# EAGLE design nRF24L01+ - ATmega328 test board (EAGLE 7.6.0)
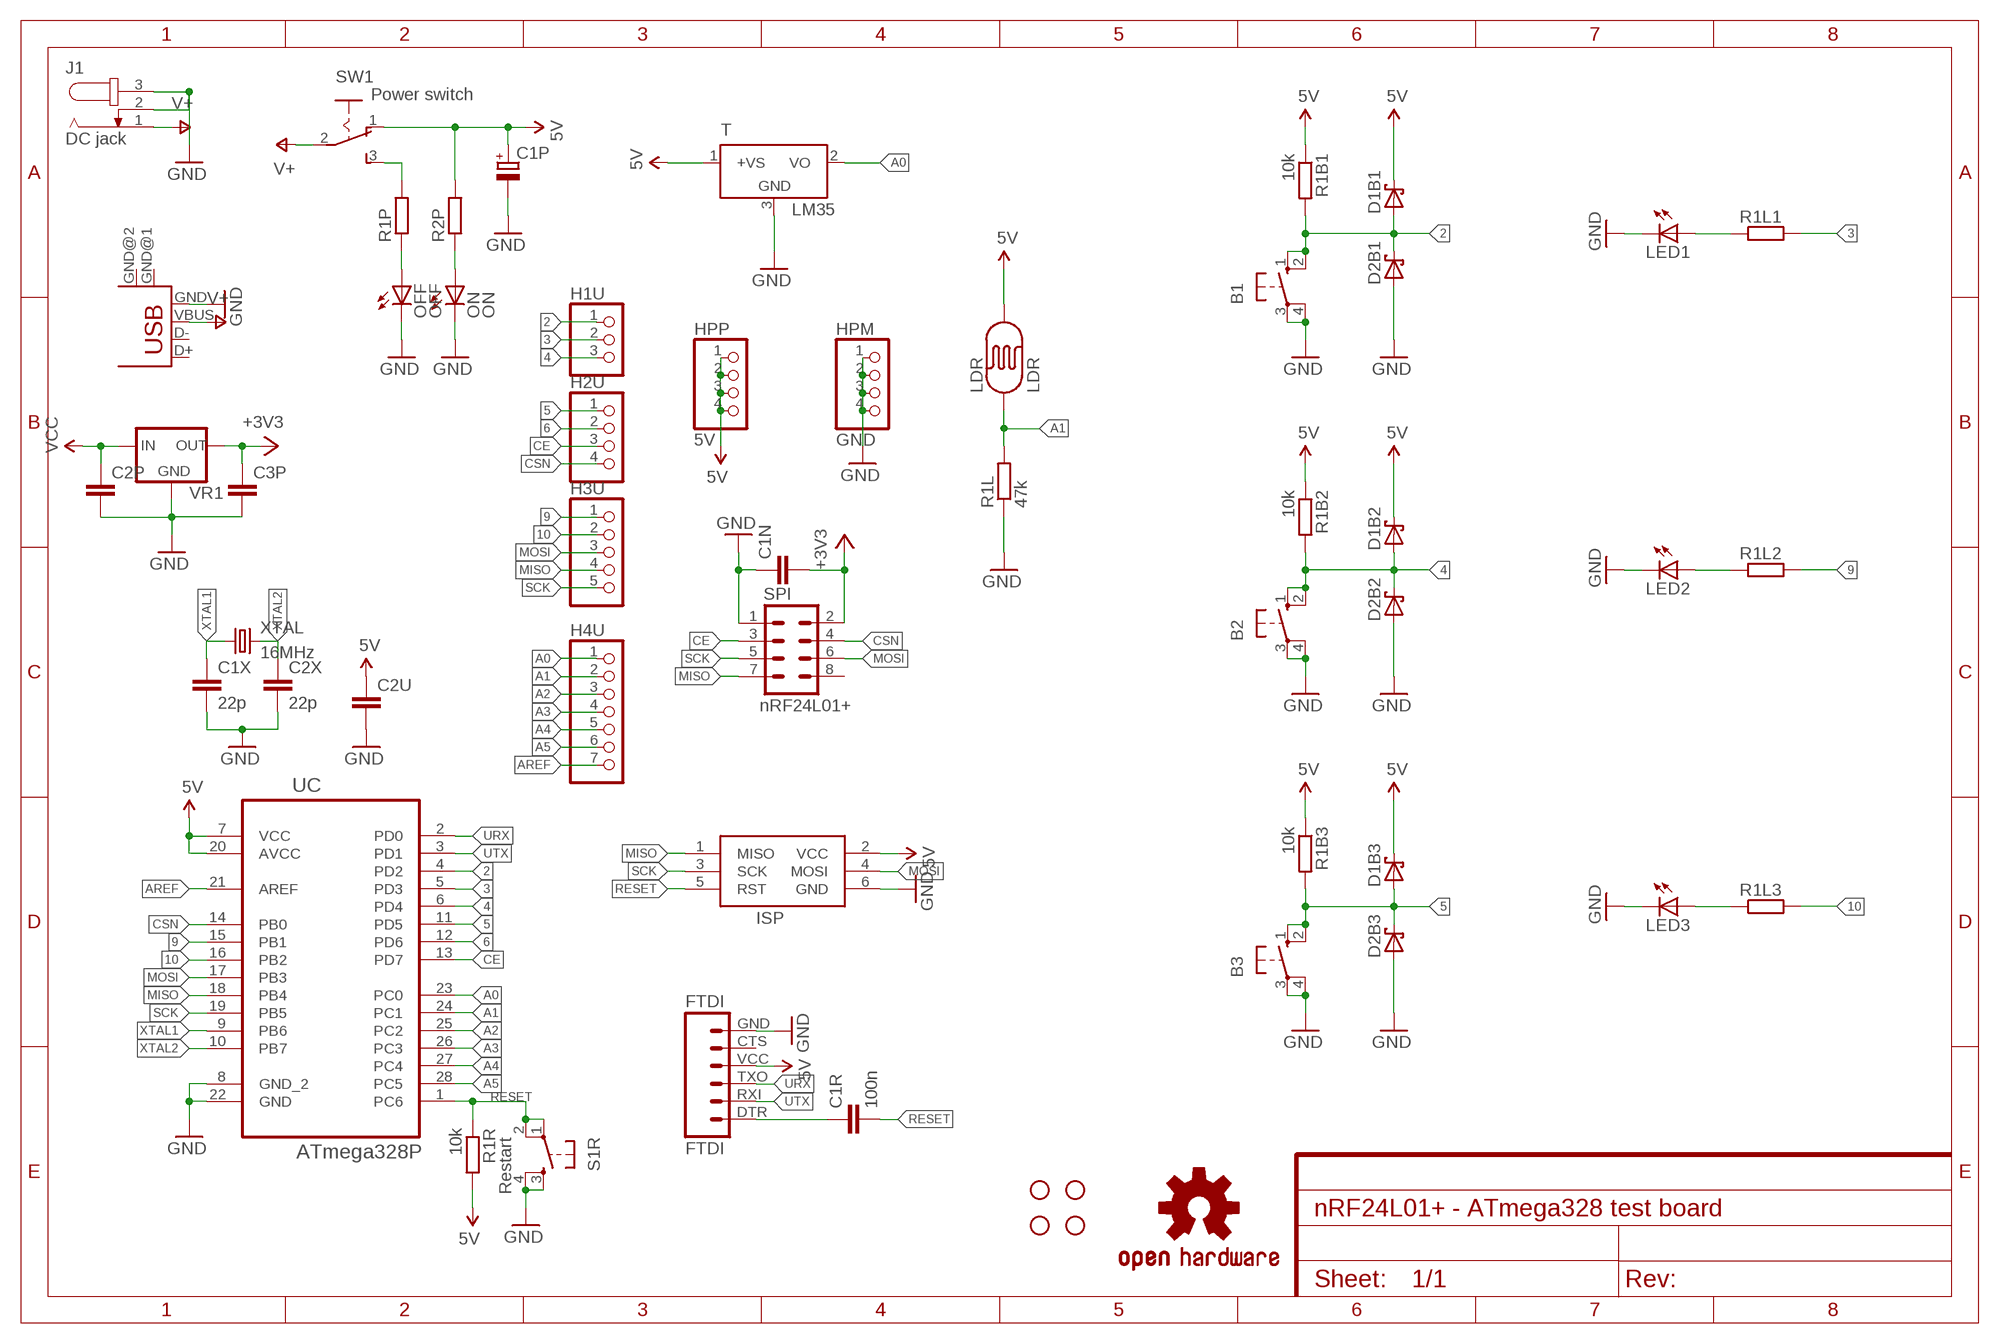
[diagram p0: schematic, sheet 1]

## Parts
B1  40-XX  [B3F-40XX]
B2  40-XX  [B3F-40XX]
B3  40-XX  [B3F-40XX]
C1N  C-EU050-025X075  [C050-025X075]
C1P  CPOL-EUE5-8.5  [E5-8,5]
C1R  100n  C-EU050-025X075  [C050-025X075]
C1X  22p  C-EU025-025X050  [C025-025X050]
C2P  C-EU050-025X075  [C050-025X075]
C2U  C-EU050-055X075  [C050-055X075]
C2X  22p  C-EU025-025X050  [C025-025X050]
C3P  C-EU050-025X075  [C050-025X075]
D1B1  SCHOTTKY-DIODEDO41-7  [DO41-7]
D1B2  SCHOTTKY-DIODEDO41-7  [DO41-7]
D1B3  SCHOTTKY-DIODEDO41-7  [DO41-7]
D2B1  SCHOTTKY-DIODEDO41-7  [DO41-7]
D2B2  SCHOTTKY-DIODEDO41-7  [DO41-7]
D2B3  SCHOTTKY-DIODEDO41-7  [DO41-7]
FTDI  FTDI  FTDI_BASICPTH  [FTDI_BASIC]
H1  STAND-OFF  [STAND-OFF]
H1U  PINHD-1X3  [1X03]
H2  STAND-OFF  [STAND-OFF]
H2U  PINHD-1X4  [1X04]
H3  STAND-OFF  [STAND-OFF]
H3U  PINHD-1X5  [1X05]
H4  STAND-OFF  [STAND-OFF]
H4U  PINHD-1X7  [1X07]
HPM  GND  PINHD-1X4  [1X04]
HPP  5V  PINHD-1X4  [1X04]
ISP  AVRISP-6  [AVRISP]
J1  DC jack  JACK-PLUG1  [SPC4078]
J2  USB mini  USB-MB-H  [USB-MB-H]
LDR  LDR  PHOTOCELLPTH  [PHOTOCELL]
LED1  LED5MM  [LED5MM]
LED2  LED5MM  [LED5MM]
LED3  LED5MM  [LED5MM]
LOGO1  OSHW-LOGOM-COPPER  [OSHW-LOGO-M_COPPER]
OFF  OFF  LED3MM  [LED3MM]
ON  ON  LED3MM  [LED3MM]
R1B1  10k  R-EU_0207/7  [0207/7]
R1B2  10k  R-EU_0207/7  [0207/7]
R1B3  10k  R-EU_0207/7  [0207/7]
R1L  47k  R-EU_0207/7  [0207/7]
R1L1  R-EU_0207/7  [0207/7]
R1L2  R-EU_0207/7  [0207/7]
R1L3  R-EU_0207/7  [0207/7]
R1P  R-EU_0207/7  [0207/7]
R1R  10k  R-EU_0207/7  [0207/7]
R2P  R-EU_0207/7  [0207/7]
S1R  Restart  TAC_SWITCHPTH  [TACTILE-PTH]
SPI  nRF24L01+  M04X2  [2X4]
SW1  Power switch  SPDT_SWITCH_2MM  [SWITCH_2MM]
T  LM35  LM35CZ  [TO92]
UC  ATmega328P  ATMEGA328P-PU  [DIP254P762X457-28]
VR1  78LXX  [78LXX]
XTAL  16MHz  CRYSTALHC49S  [HC49/S]

## Nets
2: B1.1(S) B1.2(S1) D1B1.A D2B1.C H1U.1 R1B1.2 UC.4(PD2)
3: H1U.2 R1L1.2 UC.5(PD3)
4: B2.1(S) B2.2(S1) D1B2.A D2B2.C H1U.3 R1B2.2 UC.6(PD4)
5: B3.1(S) B3.2(S1) D1B3.A D2B3.C H2U.1 R1B3.2 UC.11(PD5)
5V: C1P.+ C2U.1 D1B1.C D1B2.C D1B3.C FTDI.VCC HPP.1 HPP.2 HPP.3 HPP.4 ISP.2(VCC) LDR.2 R1B1.1 R1B2.1 R1B3.1 R1R.2 R2P.2 SW1.1 T.1(+VS) UC.7(VCC) UC.20(AVCC)
6: H2U.2 UC.12(PD6)
9: H3U.1 R1L2.2 UC.15(PB1)
10: H3U.2 R1L3.2 UC.16(PB2)
+3V3: C1N.2 C3P.1 SPI.2 VR1.OUT
A0: H4U.1 T.2(VO) UC.23(PC0)
A1: H4U.2 LDR.1 R1L.2 UC.24(PC1)
A2: H4U.3 UC.25(PC2)
A3: H4U.4 UC.26(PC3)
A4: H4U.5 UC.27(PC4)
A5: H4U.6 UC.28(PC5)
AREF: H4U.7 UC.21(AREF)
CE: H2U.3 SPI.3 UC.13(PD7)
CSN: H2U.4 SPI.4 UC.14(PB0)
GND: B1.3(P) B1.4(P1) B2.3(P) B2.4(P1) B3.3(P) B3.4(P1) C1N.1 C1P.- C1X.2 C2P.2 C2U.2 C2X.2 C3P.2 D2B1.A D2B2.A D2B3.A FTDI.GND HPM.1 HPM.2 HPM.3 HPM.4 ISP.6(GND) J1.2 J1.3 J2.GND LED1.K(C) LED2.K(C) LED3.K(C) OFF.K(C) ON.K(C) R1L.1 S1R.3 S1R.4 SPI.1 T.3(GND) UC.8(GND_2) UC.22(GND) VR1.GND
MISO: H3U.4 ISP.1(MISO) SPI.7 UC.18(PB4)
MOSI: H3U.3 ISP.4(MOSI) SPI.6 UC.17(PB3)
N$5: LED1.A R1L1.1
N$6: ON.A R2P.1
N$7: C1R.1 FTDI.DTR
N$11: OFF.A R1P.1
N$13: R1P.2 SW1.3
N$14: LED2.A R1L2.1
N$16: LED3.A R1L3.1
RESET: C1R.2 ISP.5(RST) R1R.1 S1R.1 S1R.2 UC.1(PC6)
SCK: H3U.5 ISP.3(SCK) SPI.5 UC.19(PB5)
URX: FTDI.TXO UC.2(PD0)
UTX: FTDI.RXI UC.3(PD1)
V+: J1.1 J2.VBUS SW1.2
VCC: C2P.1 VR1.IN
XTAL1: C1X.1 UC.9(PB6) XTAL.1
XTAL2: C2X.1 UC.10(PB7) XTAL.2
Unconnected: FTDI.CTS J2.D+ J2.D- J2.GND@1(GND) J2.GND@2(GND) SPI.8

## Library data of the parts
B1-B3 = switch-omron:40-XX: OMRON SWITCH; MF: OMRON COMPONENTS USA; MPN: B3F-4000; OC_FARNELL: 176434; OC_NEWARK: 36K3105
C1N C1R C1X C2P C2X C3P = resistor:C-EU: CAPACITOR, European symbol
C1P = rcl:CPOL-EU: POLARIZED CAPACITOR, European symbol
C2U = rcl:C-EU: CAPACITOR, European symbol
D1B1-D1B3 D2B1-D2B3 = adafruit:SCHOTTKY-DIODE: Schottky Diode
FTDI = SparkFun-Connectors:FTDI_BASIC: FTDI Basic header with labels
H1-H4 = SparkFun-Electromechanical:STAND-OFF: #4 Stand Off This is the mechanical footprint for a #4 phillips button head screw. Use the keepout ring to avoid running the screw head into surrounding components. SKU : PRT-00447
H1U = pinhead:PINHD-1X3: PIN HEADER
H2U HPM HPP = pinhead:PINHD-1X4: PIN HEADER
H3U = pinhead:PINHD-1X5: PIN HEADER
H4U = pinhead:PINHD-1X7: PIN HEADER
ISP = adafruit:AVRISP: AVR ISP HEADER Standard 6 pin header for AVR programming
J1 = con-jack:JACK-PLUG: DC POWER JACK Power Jack, DC, Right Angle, Through Hole, Rated 5A at 16VDC, PC Terminals Distributor: Farnell (www.Farnell.de) Drawing: 84N1161.pdf / 84N1162.pdf Manufacturer: SPC Technology (www.spctechnology.com) Type: SPC4077 / SPC 4078; OC_FARNELL: unknown; OC_NEWARK: unknown
J2 = con-usb-2:USB: USB Connectors
LDR = SparkFun-Sensors:PHOTOCELL: CdS photoresistor. This is a low cost way to detect light levels. Resistance decreases with more incoming light. SparkFun SKU: SEN-09088
LED1-LED3 OFF ON = adafruit:LED: LED OSRAM: - CHIPLED LG R971, LG N971, LY N971, LG Q971, LY Q971, LO R971, LY R971 LH N974, LH R974 LS Q976, LO Q976, LY Q976 LO Q996 - Hyper CHIPLED LW Q18S LB Q993, LB Q99A, LB R99A - SideLED LS A670, LO A670, LY A670, LG A670, LP A670 LB A673, LV A673, LT A673, LW A673 LH A674 LY A675 LS A676, LA A676, LO A676, LY A676, LW A676 LS A679, LY A679, LG A679 - Hyper Micro SIDELED® LS Y876, LA Y876, LO Y876, LY Y876 LT Y87S - SmartLED LW L88C, LW L88S LB L89C, LB L89S, LG L890 LS L89K, LO L89K, LY L89K LS L896, LA L896, LO L896, LY L896 - TOPLED LS T670, LO T670, LY T670, LG T670, LP T670 LSG T670, LSP T670, LSY T670, LOP T670, LYG T670 LG T671, LOG T671, LSG T671 LB T673, LV T673, LT T673, LW T673 LH T674 LS T676, LA T676, LO T676, LY T676, LB T676, LH T676, LSB T676, LW T676 LB T67C, LV T67C, LT T67C, LS T67K, LO T67K, LY T67K, LW E67C LS E67B, LA E67B, LO E67B, LY E67B, LB E67C, LV E67C, LT E67C LW T67C LS T679, LY T679, LG T679 LS T770, LO T770, LY T770, LG T770, LP T770 LB T773, LV T773, LT T773, LW T773 LH T774 LS E675, LA E675, LY E675, LS T675 LS T776, LA T776, LO T776, LY T776, LB T776 LHGB T686 LT T68C, LB T68C - Hyper Mini TOPLED® LB M676 - Mini TOPLED Santana® LG M470 LS M47K, LO M47K, LY M47K Source: http://www.osram.convergy.de/
LOGO1 = SparkFun-Aesthetics:OSHW-LOGO: Open-Source Hardware (OSHW) Logo This logo indicates the piece of hardware it is found on incorporates a OSHW license and/or adheres to the definition of open source hardware found here: http://freedomdefined.org/OSHW
R1B1-R1B3 R1L R1L1-R1L3 R1P R1R R2P = resistor:R-EU_: RESISTOR, European symbol
S1R = SparkFun:TAC_SWITCH: Momentary Switch Button commonly used for reset or general input. Spark Fun Electronics SKU : COM-00097
SPI = SparkFun-Connectors:M04X2: .1" header, two rows of four.; MF: OLIMEX; MPN: MOD-NRF24LR; OC_FARNELL: 1701547
SW1 = VaSe7u - Switches:SPDT_SWITCH_2MM: SPDT switch, 2mm pitch with mounting holes.
T = LM35:LM35: Single-Supply Centigrade Temperature Sensor Vout = (10mV/°C x Temp °C) +5mmmV Source: http://www.national.com/ds/LM/LM35.pdf
UC = Atmel by Element14 (batch 1):ATMEGA328P-PU: 8-bit Microcontroller with In-System Programmable Flash; MPN: ATMEGA328P-PU; OC_FARNELL: 1715487; OC_NEWARK: 15R0268; PACKAGE: PDIP-28; SUPPLIER: Atmel
VR1 = v-reg:78LXX: VOLTAGE REGULATOR
XTAL = crystal:CRYSTAL: CRYSTAL; OC_FARNELL: 1667008; OC_NEWARK: unknown

## Board
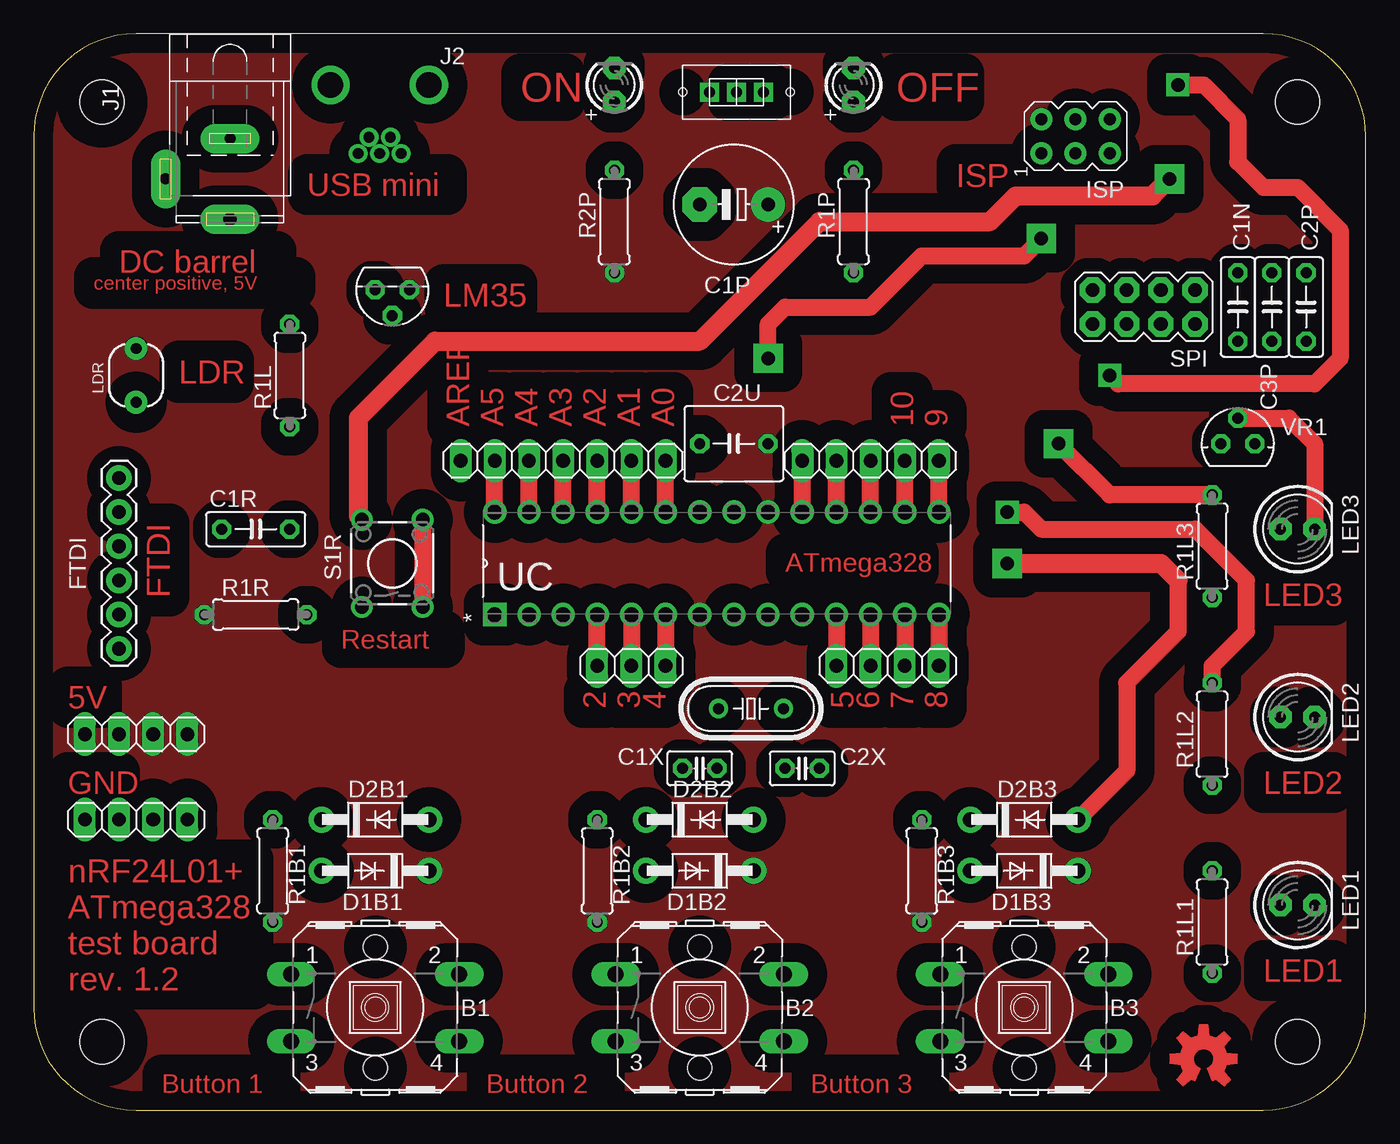
[diagram p1: board, top side]
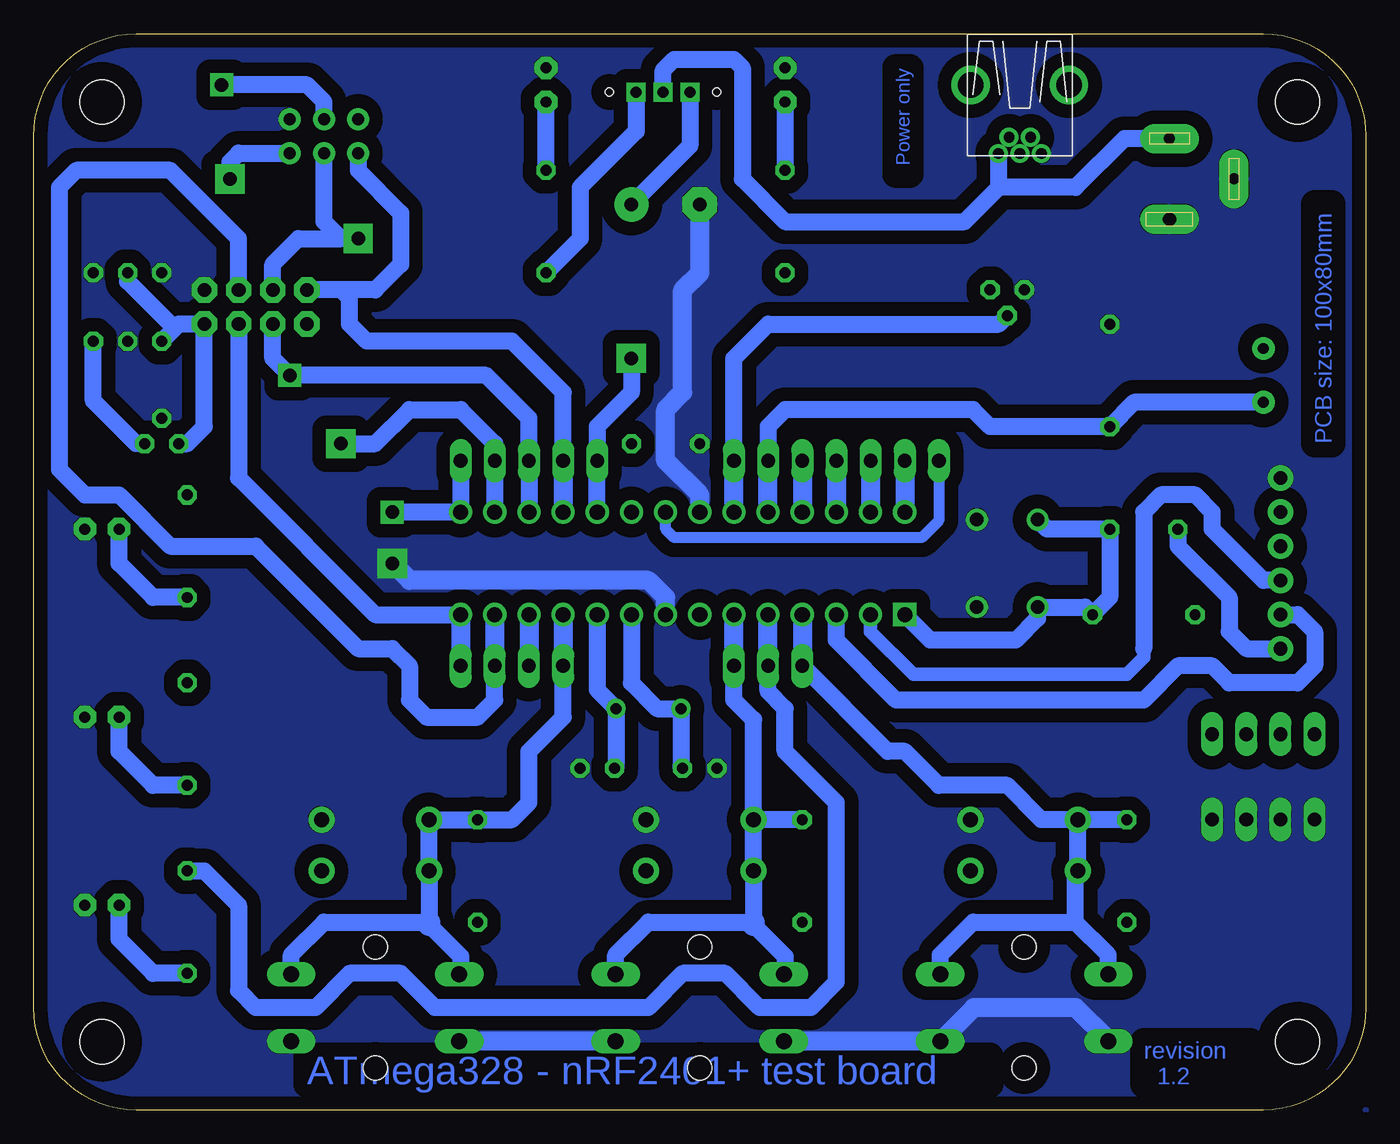
[diagram p2: board, bottom side, seen from below]

Size 99.06 x 80.01 mm. Coordinates in mm from the lower left corner, seen from the top.
Outline: 7.62,0 91.44,0 arc90 99.06,7.62 99.06,72.39 arc90 91.44,80.01 7.62,80.01 arc90 0,72.39 0,7.62 arc90 7.62,0
Copper layers (1*16): Top 0.035mm / dielectric 1.5mm / Bottom 0.035mm
Design rules "VaSe7u - Toner transfer method *": minimum track width 16mil, minimum drill 0.8mm, track to track 12mil, track to pad 12mil, pad to pad 10mil, via to via 12mil, smd to smd 8mil, copper to edge 20mil, drill to drill 8mil, minimum pad ring 12mil, minimum via ring 14mil, stop-mask expansion 4mil, vias tented up to drill 0mil, thermal gap 2mil

### Footprints (pad centres in the part's own frame; a part is rotated, then mirrored left to right if it is on the bottom)
B3F-40XX = drill 1.194 long: 1 -6.248,2.489; 2 6.248,2.489; 3 -6.248,-2.489; 4 6.248,-2.489 | hole 1.803: 0,-4.496; 0,4.496
C050-025X075 = drill 0.813 octagon: 1 -2.54,0; 2 2.54,0
E5-8,5 = drill 1.016 pad 2.54: + -2.54,0 | drill 1.016 pad 2.54 octagon: - 2.54,0
C025-025X050 = drill 0.813 octagon: 1 -1.27,0; 2 1.27,0
C050-055X075 = drill 0.813 octagon: 1 -2.54,0; 2 2.54,0
DO41-7 = drill 1.118 pad 1.93: A 4,0; C -4,0
FTDI_BASIC = drill 1.016 pad 1.88: CTS 10.16,0; DTR 0,0; GND 12.7,0; RXI 2.54,0; TXO 5.08,0; VCC 7.62,0
STAND-OFF = hole 3.302: 0,0
1X03 = drill 1.016 long: 1 -2.54,0; 2 0,0; 3 2.54,0
1X04 = drill 1.016 long: 1 -3.81,0; 2 -1.27,0; 3 1.27,0; 4 3.81,0
1X05 = drill 1.016 long: 1 -5.08,0; 2 -2.54,0; 3 0,0; 4 2.54,0; 5 5.08,0
1X07 = drill 1.016 long: 1 -7.62,0; 2 -5.08,0; 3 -2.54,0; 4 0,0; 5 2.54,0; 6 5.08,0; 7 7.62,0
AVRISP = drill 0.9 pad 1.626: 1 -1.27,2.54; 2 1.27,2.54; 3 -1.27,0; 4 1.27,0; 5 -1.27,-2.54; 6 1.27,-2.54
SPC4078 = drill 0.8 pad 2.184 long: 1 -3,0; 2 0,-4.8 | drill 1 pad 2.184 long: 3 3,0
USB-MB-H = drill 0.8: D+ 5.1,0; D- 3.9,0.8; GND 5.1,-1.6; ID 3.9,-0.8; VBUS 5.1,1.6 | drill 1.9: GND@1 0,3.65; GND@2 0,-3.65
PHOTOCELL = drill 0.8 pad 1.676: 1 -2,0; 2 2,0
LED5MM = drill 0.813 pad 1.676 octagon: A -1.27,0; K 1.27,0
LED3MM = drill 0.813 pad 1.676 octagon: A -1.27,0; K 1.27,0
0207/7 = drill 0.813 octagon: 1 -3.81,0; 2 3.81,0
TACTILE-PTH = drill 1.016: 1 -3.251,2.261; 2 3.251,2.261; 3 -3.251,-2.261; 4 3.251,-2.261
2X4 = drill 1.016 pad 1.88 octagon: 1 -3.81,-1.27; 2 -3.81,1.27; 3 -1.27,-1.27; 4 -1.27,1.27; 5 1.27,-1.27; 6 1.27,1.27; 7 3.81,-1.27; 8 3.81,1.27
SWITCH_2MM = drill 0.8 square: 1 2,2; 2 4,2; 3 6,2 | hole 0.6: 0,2; 8,2
TO92 = drill 0.813 octagon: 1 -1.27,0; 2 0,1.905; 3 1.27,0
DIP254P762X457-28 = drill 1.118 square: 1 -7.62,33.02 | drill 1.118: 2 -7.62,30.48; 3 -7.62,27.94; 4 -7.62,25.4; 5 -7.62,22.86; 6 -7.62,20.32; 7 -7.62,17.78; 8 -7.62,15.24; 9 -7.62,12.7; 10 -7.62,10.16; 11 -7.62,7.62; 12 -7.62,5.08; 13 -7.62,2.54; 14 -7.62,0; 15 0,0; 16 0,2.54; 17 0,5.08; 18 0,7.62; 19 0,10.16; 20 0,12.7; 21 0,15.24; 22 0,17.78; 23 0,20.32; 24 0,22.86; 25 0,25.4; 26 0,27.94; 27 0,30.48; 28 0,33.02
78LXX = drill 0.813 octagon: GND 0,1.905; IN 1.27,0; OUT -1.27,0
HC49/S = drill 0.813: 1 -2.413,0; 2 2.413,0

### Placement (x,y rotation side)
B1  25.4,7.62 0 top
B2  49.53,7.62 0 top
B3  73.66,7.62 0 top
C1N  89.53,59.69 270 top
C1P  52.07,67.31 180 top
C1R  16.51,43.18 0 top
C1X  49.53,25.4 180 top
C2P  94.61,59.69 90 top
C2U  52.07,49.53 180 top
C2X  57.15,25.4 0 top
C3P  92.08,59.69 270 top
D1B1  25.4,17.78 180 top
D1B2  49.53,17.78 180 top
D1B3  73.66,17.78 180 top
D2B1  25.4,21.59 0 top
D2B2  49.53,21.59 0 top
D2B3  73.66,21.59 0 top
FTDI  6.35,34.29 90 top
H1  5.08,5.08 0 top
H1U  44.45,33.02 0 top
H2  93.98,5.08 0 top
H2U  63.5,33.02 0 top
H3  93.98,74.93 0 top
H3U  62.23,48.26 180 top
H4  5.08,74.93 0 top
H4U  39.37,48.26 180 top
HPM  7.62,21.59 0 top
HPP  7.62,27.94 0 top
ISP  77.47,72.39 90 top
J1  14.61,69.22 270 top
J2  25.73,76.2 270 top
LDR  7.62,54.61 90 top
LED1  93.98,15.24 0 top
LED2  93.98,29.21 0 top
LED3  93.98,43.18 0 top
LOGO1  87,3.81 0 top
OFF  60.96,76.2 90 top
ON  43.18,76.2 90 top
R1B1  17.78,17.78 90 top
R1B2  41.91,17.78 90 top
R1B3  66.04,17.78 90 top
R1L  19.05,54.61 270 top
R1L1  87.63,13.97 90 top
R1L2  87.63,27.94 90 top
R1L3  87.63,41.91 90 top
R1P  60.96,66.04 270 top
R1R  16.51,36.83 180 top
R2P  43.18,66.04 270 top
S1R  26.67,40.64 90 top
SPI  82.55,59.69 180 top
SW1  48.26,73.66 0 top
T  26.67,60.96 180 top
UC  67.31,44.45 90 top
VR1  89.53,49.53 0 top
XTAL  53.34,29.84 0 top

### Tracks (layer width: path | path; a pad name or v marks a point on that pad's centre or on a via)
2
  Top 1.27: H1U.1 UC.4
  Bottom 1.27: R1B1.2 D2B1.C | B1.1 19.15,11.53 21.59,13.97 | 21.59,13.97 21.59,17.59 | D1B1.A D2B1.C | D2B1.C 24.13,21.59 26.67,24.13 31.75,24.13 34.29,26.67 35.56,26.67 H1U.1 | B1.2 31.65,11.53 29.21,13.97 21.59,13.97
  Bottom 1.422: UC.4 H1U.1 | 21.59,17.59 D1B1.A | B1.2 31.7,10.11 31.75,10.16 31.7,10.16 B1.2
3
  Top 1.27: UC.5 H1U.2
  Bottom 1.27: R1L1.2 86.36,17.78 83.82,15.24 83.82,8.89 82.55,7.62 78.11,7.62 75.56,10.16 71.75,10.16 69.22,7.62 53.34,7.62 50.8,10.16 47.62,10.16 45.09,7.62 41.27,7.62 39.37,9.53 39.37,22.86 43.18,26.67 43.18,29.84 44.45,31.11 H1U.2
  Bottom 1.422: H1U.2 UC.5
4
  Top 1.27: UC.6 H1U.3
  Bottom 1.27: D2B2.C D1B2.A 45.53,13.97 53.34,13.97 55.78,11.53 B2.2 | D2B2.C 45.53,29.02 46.99,30.48 H1U.3 | 45.53,13.78 43.18,11.43 43.18,10.21 B2.1 | R1B2.2 D2B2.C
  Bottom 1.422: H1U.3 UC.6
  Bottom 1.676: 45.53,13.97 45.53,13.78
5
  Top 1.27: UC.11 H2U.1
  Bottom 1.27: H2U.1 59.69,29.21 62.23,26.67 62.23,22.86 63.5,21.59 R1B3.2 D2B3.C D1B3.A 69.66,13.97 77.47,13.97 79.91,11.53 B3.2 | 69.66,13.78 67.31,11.43 67.31,10.21
  Bottom 1.422: UC.11 H2U.1
  Bottom 1.676: 69.66,13.97 69.66,13.78 | 67.31,10.21 B3.1
5V
  Bottom 1.27: SW1.1 50.26,71.66 C1P.+
  pour Top (isolate 1.422): -2.54,81.28 100.33,81.28 100.33,-2.54 -2.54,-2.54
6
  Top 1.27: UC.12 H2U.2
  Bottom 1.422: UC.12 H2U.2
9  (via drill 1)
  Top 1.27: R1L2.2 87.63,33.02 90.17,35.56 90.17,39.37 86.36,43.18 74.93,43.18 73.66,44.45 v72.39,44.45 | UC.15 H3U.1
  Bottom 1.27: H3U.1 UC.15 v72.39,44.45
10  (via drill 1 pad 2.18)
  Top 1.27: R1L3.2 80.01,45.72 v76.2,49.53 | UC.16 H3U.2
  Bottom 1.27: UC.16 H3U.2 64.77,49.53 67.31,52.07 71.12,52.07 73.66,49.53 v76.2,49.53
+3V3
  Bottom 1.27: 88.58,58.1 88.27,58.42 SPI.2 86.36,50.8 87.63,49.53 VR1.OUT | 88.58,58.1 C1N.2 | C3P.1 92.08,61.59 88.58,58.1
A0
  Top 1.27: UC.23 H4U.1
  Bottom 1.27: H4U.1 46.99,55.88 44.45,58.42 27.3,58.42 T.2
  Bottom 1.422: UC.23 H4U.1
A1
  Top 1.27: UC.24 H4U.2
  Bottom 1.27: LDR.1 17.24,52.61 R1L.2 27.94,50.8 29.21,52.07 43.18,52.07 44.45,50.8 H4U.2
  Bottom 1.422: UC.24 H4U.2
A2
  Top 1.27: UC.25 H4U.3
  Bottom 1.422: H4U.3 UC.25
A3
  Top 1.27: UC.26 H4U.4
  Bottom 1.422: H4U.4 UC.26
A4
  Top 1.27: UC.27 H4U.5
  Bottom 1.422: H4U.5 UC.27
A5
  Top 1.27: UC.28 H4U.6
  Bottom 1.422: H4U.6 UC.28
AREF
  Bottom 0.813: H4U.7 31.75,43.81 33.02,42.55 51.44,42.55 52.07,43.18 UC.21
CE
  Top 1.27: UC.13 H2U.3
  Bottom 1.27: H2U.3 64.77,30.48 66.04,29.21 69.85,29.21 71.12,30.48 71.12,33.02 72.39,34.29 74.93,34.29 82.55,41.91 88.9,41.91 92.71,45.72 95.25,45.72 97.16,47.62 97.16,68.58 95.89,69.85 88.9,69.85 83.82,64.77 SPI.3
  Bottom 1.422: UC.13 H2U.3
CSN
  Top 1.27: UC.14 H2U.4
  Bottom 1.27: SPI.4 83.82,46.99 73.66,36.83 UC.14
  Bottom 1.422: UC.14 H2U.4
GND  (via drill 1 pad 2.18)
  Top 1.27: S1R.4 S1R.3 | VR1.GND 93.34,51.44 95.25,49.53 LED3.K | 85.09,39.37 85.09,35.56 81.28,31.75 81.28,25.21 D2B3.A
  Top 1.422: v72.39,40.64 83.82,40.64 85.09,39.37
  Bottom 1.422: UC.22 49.53,45.72 52.07,48.26 52.07,52.07 50.8,53.34 50.8,60.96 49.53,62.23 C1P.- | UC.8 52.07,38.1 53.34,39.37 71.12,39.37 v72.39,40.64 | B1.3 19.15,5.18 21.59,7.62 29.16,7.62 B1.4 B2.3 | B2.4 B3.3
  pour Bottom (isolate 1.016): -1.27,82.55 101.6,82.55 101.6,-1.27 -1.27,-1.27
MISO
  Top 1.27: UC.18 H3U.4
  Bottom 1.27: ISP.1 74.93,69.85 71.75,66.67 71.75,62.87 73.66,60.96 76.2,60.96 | 76.2,60.96 SPI.7 | H3U.4 59.69,53.34 63.5,57.15 74.3,57.15 75.56,58.42 75.56,60.33 76.2,60.96
  Bottom 1.422: H3U.4 UC.18
MOSI  (via drill 1)
  Top 1.27: v80.01,54.61 80.64,53.98 95.25,53.98 97.16,55.88 97.16,65.41 93.98,68.58 91.44,68.58 89.53,70.48 89.53,73.66 87,76.2 v85.09,76.2 | UC.17 H3U.3
  Bottom 1.27: UC.17 H3U.3 62.23,51.44 65.41,54.61 v80.01,54.61 81.28,55.88 SPI.6 | ISP.4 77.47,74.93 78.74,76.2 v85.09,76.2
N$1
  pour Bottom: 0.06,-0.14 arc9 0.08,-0.13 0.14,-0.18 0.18,-0.14 0.13,-0.08 arc19 0.15,-0.03 0.22,-0.03 0.22,0.03 0.15,0.03 arc19 0.13,0.08 0.18,0.14 0.14,0.18 0.08,0.13 arc19 0.03,0.15 0.03,0.22 -0.03,0.22 -0.03,0.15 arc19 -0.08,0.13 -0.14,0.18 -0.18,0.14 -0.13,0.08 arc19 -0.15,0.03 -0.22,0.03 -0.22,-0.03 -0.15,-0.03 arc19 -0.13,-0.08 -0.18,-0.14 -0.14,-0.18 -0.08,-0.13 arc9 -0.06,-0.14 -0.03,-0.06 arc-68 -0.07,0 arc-247 0.03,-0.06
N$5
  Bottom 1.27: R1L1.1 90.17,10.16 92.71,12.7 LED1.A
N$6
  Bottom 1.27: ON.A R2P.1
N$7
  Bottom 1.27: C1R.1 13.97,41.91 10.16,38.1 10.16,35.56 8.89,34.29 FTDI.DTR
N$11
  Bottom 1.27: R1P.1 OFF.A
N$13
  Bottom 1.27: SW1.3 54.26,72.74 58.42,68.58 58.42,64.77 R1P.2
N$14
  Bottom 1.27: R1L2.1 90.17,24.13 92.71,26.67 LED2.A
N$16
  Bottom 1.27: R1L3.1 90.17,38.1 92.71,40.64 LED3.A
RESET  (via drill 1 pad 2.18)
  Top 1.422: S1R.2 24.13,44.17 24.13,51.44 29.84,57.15 49.53,57.15 58.42,66.04 71.12,66.04 73.03,67.94 83.19,67.94 v84.45,69.22
  Bottom 1.27: S1R.2 23.7,43.18 C1R.2 19.05,38.1 R1R.1 20.88,37.39 S1R.1 24.41,36.55 26.04,34.92 32.38,34.92 UC.1 | v84.45,69.22 84.45,70.48 83.82,71.12 ISP.5
SCK  (via drill 1 pad 2.18)
  Top 1.27: v54.61,55.88 54.61,58.42 55.88,59.69 62.23,59.69 66.04,63.5 73.66,63.5 v74.93,64.77 | UC.19 H3U.5
  Bottom 1.27: UC.19 H3U.5 57.15,50.8 54.61,53.34 v54.61,55.88 | v74.93,64.77 76.2,64.77 | 76.2,64.77 77.47,66.04 ISP.3 | SPI.5 81.28,62.87 79.38,64.77 76.2,64.77
URX
  Bottom 1.016: 16.51,34.29 16.51,33.66 17.78,32.38 33.66,32.38 36.83,35.56 UC.2
  Bottom 1.27: FTDI.TXO 7.62,39.37 11.43,43.18 11.43,44.45 12.7,45.72 15.24,45.72 16.51,44.45 16.51,34.29
UTX
  Bottom 1.27: FTDI.RXI 5.08,36.83 3.81,35.56 3.81,33.02 5.08,31.75 10.16,31.75 11.43,33.02 13.97,33.02 16.51,30.48 34.92,30.48 39.37,34.92 UC.3
V+
  Bottom 1.27: SW1.2 52.26,77.28 51.44,78.11 46.99,78.11 46.35,77.47 46.35,69.22 43.18,66.04 29.84,66.04 27.3,68.58 | 27.3,68.58 27.3,71.08 J2.VBUS | J1.1 17.95,72.22 21.59,68.58 27.3,68.58
VCC
  Bottom 1.27: VR1.IN 91.44,49.53 94.61,52.7 C2P.1
XTAL1
  Bottom 1.27: C1X.1 50.93,25.53 XTAL.1 52.7,29.84 54.61,31.75 UC.9
XTAL2
  Bottom 1.27: UC.10 57.15,31.24 XTAL.2 55.75,25.53 C2X.1

### Text on the board
Top: ON | OFF | ISP | USB mini | DC barrel | center positive, 5V | LM35 | LDR | AREF | A5 | A4 | A3 | A2 | A1 | A0 | 10 | 9 | ATmega328 | FTDI | LED3 | Restart | 5V | 2 | 3 | 4 | 5 | 6 | 7 | 8 | GND | LED2 | LED1 | nRF24L01+ / ATmega328 / test board / rev. 1.2 | Button 1 | Button 2 | Button 3
Bottom: Power only | PCB size: 100x80mm | revision / 1.2 | ATmega328 - nRF2401+ test board